# Altium schematic sheet componant_example.SchDoc
size A4; SheetNumber: 5; SheetTotal: 6
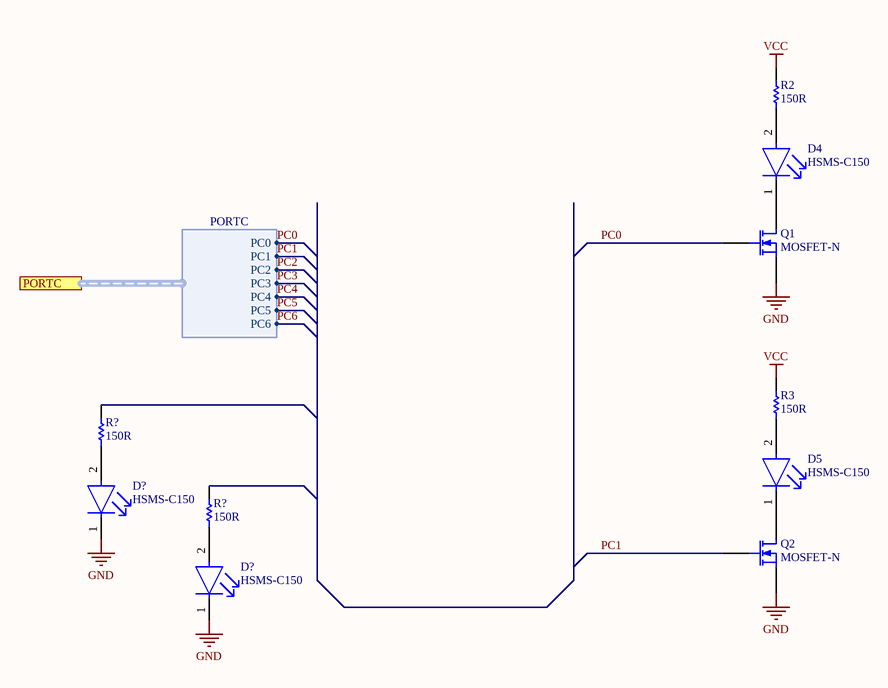
[diagram p0: componant_example.SchDoc]

## Parts
(Parts that share a designator on the sheet are numbered #1, #2 ... from top to bottom, then left to right.)
D4  HSMS-C150  [FP-HSMS-C150-MFG]
D5  HSMS-C150  [FP-HSMS-C150-MFG]
D?#1  HSMS-C150  [FP-HSMS-C150-MFG]
D?#2  HSMS-C150  [FP-HSMS-C150-MFG]
Q1  MOSFET-N
Q2  MOSFET-N
R2  150R  [RES 0603 SILK]
R3  150R  [RES 0603 SILK]
R?#1  150R  [RES 0603 SILK]
R?#2  150R  [RES 0603 SILK]

## Ports
PORTC (harness PORTC)

## Harnesses
PORTC: PC0, PC1, PC2, PC3, PC4, PC5, PC6

## Nets
GND: D?#1.1(C) D?#2.1(C) Q1.3(S) Q2.3(S)
VCC: R2.2 R3.2
PC0: Q1.2(G) ; port PORTC.PC0
PC1: Q2.2(G) ; port PORTC.PC1
PC2: port PORTC.PC2
PC3: port PORTC.PC3
PC4: port PORTC.PC4
PC5: port PORTC.PC5
PC6: port PORTC.PC6
NetD4_1: D4.1(C) Q1.1(D)
NetD4_2: D4.2(A) R2.1
NetD5_1: D5.1(C) Q2.1(D)
NetD5_2: D5.2(A) R3.1
NetD?#1_2: D?#1.2(A) R?#1.1
NetD?#2_2: D?#2.2(A) R?#2.1

Not connected (* = marked no-connect by the designer): R?#1 2; R?#2 2

## Library data of the parts
D4 D5 D?#1 D?#2 = CMP-21615-000001-1: LED RED DIFFUSED CHIP SMD; Luminous Intensity: 10mcd; Power Dissipation: 65mW; Viewing Angle: 170°; Number of Elements: 1; Forward Current: 20mA; Lens Color: White; Lens Style: Rectangular; Wavelength: 626nm; Forward Voltage: 2.1V; Reverse Voltage: 5V; Number of Pins: 2; Color: Red; Lead Free: Lead Free; Width: 1.6mm; Length: 3.2mm; REACH SVHC: No SVHC; Height: 1.1mm; Depth: 1.6mm; Power Rating: 65mW; Package Quantity: 1; Illumination Color: Red; Radiation Hardening: No; Case Code (Imperial): 1206; Max Operating Temperature: 85°C; Test Current: 20mA; Case/Package: 1206; Lens Transparency: Diffused; Number of LEDs: 1; Packaging: Tape and Reel; Mount: Surface Mount; Min Operating Temperature: -40°C; Case Code (Metric): 3216; Dominant Wavelength: 626nm
Q1 Q2 = 2N7002: N-Channel MOSFET / 2N7002,215 (SOT23) package; Published: 8-Jun-2000; LatestRevisionDate: 17-Jul-2002; LatestRevisionNote: Re-released for DXP Platform.; PackageVersion: 1995/1996; PackageReference: E3; Publisher: Altium Limited; PackageDescription: TO, Flat Index; 3 In-Line, Axial Leads; Body Dia. 4.6mm; Lead Dia. 0.5 mm (max)
R2 R3 R?#1 R?#2 = 150R: Resistor; Published: 8-Jun-2000; LatestRevisionDate: 17-Jul-2002; LatestRevisionNote: Re-released for DXP Platform.; PackageReference: AXIAL-0.3; Publisher: Altium Limited; PackageDescription: Axial Device, Thru-Hole; 2 Leads; 0.3 in Pin Spacing